# EAGLE design Kodi Remote (EAGLE 7.2.0)
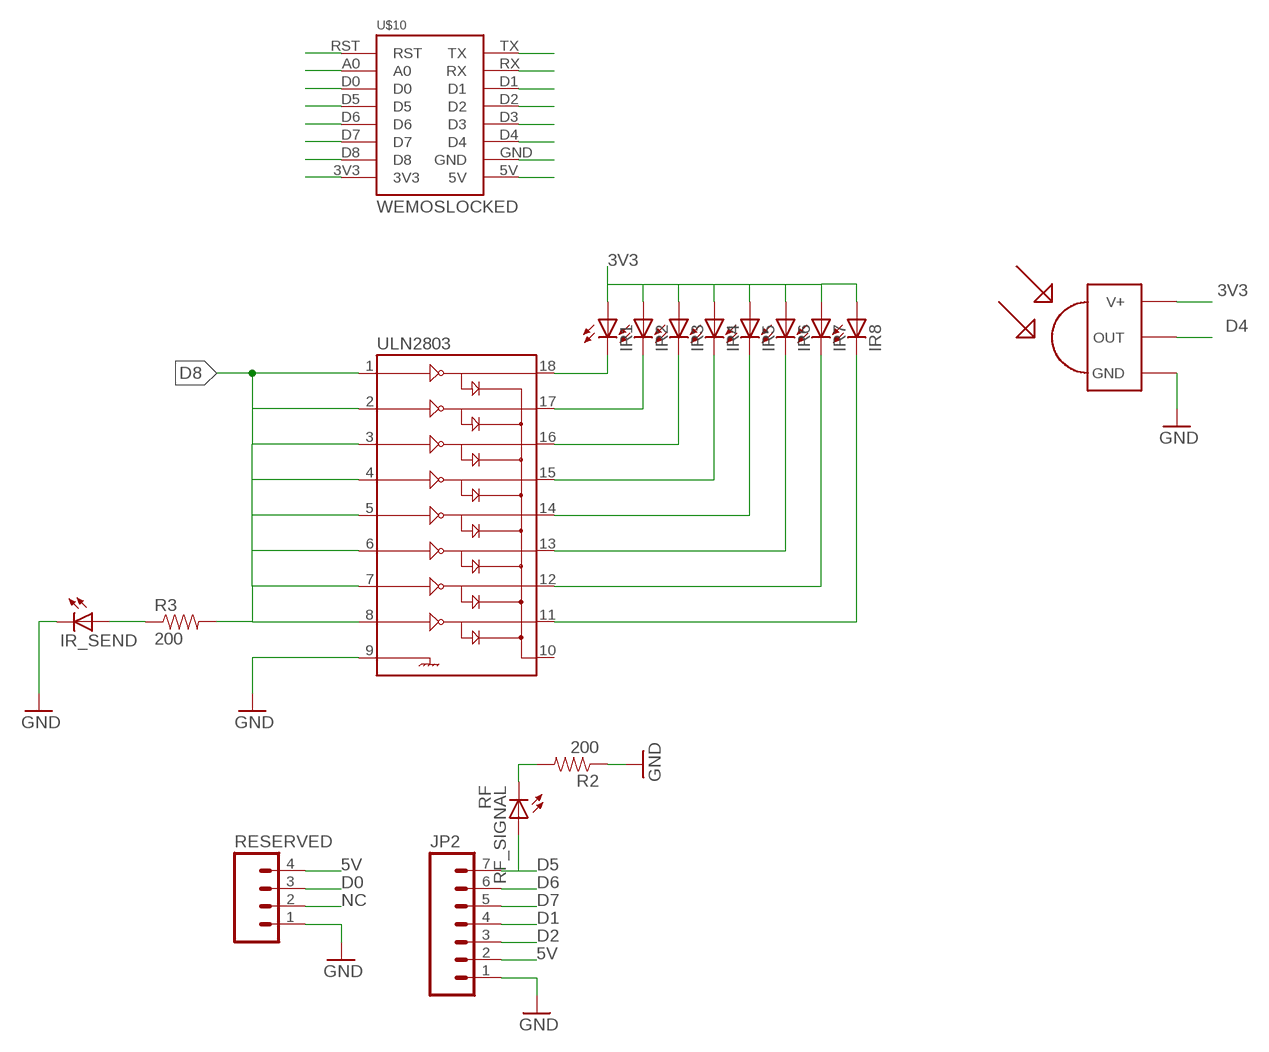
[diagram p0: schematic, sheet 1]

## Parts
IR1  LED5MM  [LED5MM]
IR2  LED5MM  [LED5MM]
IR3  LED5MM  [LED5MM]
IR4  LED5MM  [LED5MM]
IR5  LED5MM  [LED5MM]
IR6  LED5MM  [LED5MM]
IR7  LED5MM  [LED5MM]
IR8  LED5MM  [LED5MM]
IR_SEND  LED3MM  [LED3MM]
JP2  M07  [1X07]
R2  200  RESISTOR0805-RES  [0805]
R3  200  RESISTOR0805-RES  [0805]
RESERVED  M04PTH  [1X04]
RF_SIGNAL  RF  LED3MM  [LED3MM]
TSOP1838  TSOP1838  [TSOP18XX]
U$10  WEMOSLOCKED  [WEMOS_LOCKED]
ULN2803  ULN2803DIP  [DIL18]

## Nets
3V3: IR1.A IR2.A IR3.A IR4.A IR5.A IR6.A IR7.A IR8.A TSOP1838.VCC(V+) U$10.3V3
5V: JP2.2 RESERVED.4 U$10.5V
A1: U$10.A0
D0: RESERVED.3 U$10.D0
D1: JP2.4 U$10.D1
D2: JP2.3 U$10.D2
D3: U$10.D3
D4: TSOP1838.OUT U$10.D4
D5: JP2.7 RF_SIGNAL.A U$10.D5
D6: JP2.6 U$10.D6
D7: JP2.5 U$10.D7
D8: R3.2 U$10.D8 ULN2803.1 ULN2803.2 ULN2803.3 ULN2803.4 ULN2803.5 ULN2803.6 ULN2803.7 ULN2803.8
GND: IR_SEND.K(C) JP2.1 R2.1 RESERVED.1 TSOP1838.GND ULN2803.9
GND1: U$10.GND
IR4: IR4.K(C) ULN2803.15
N$1: R2.2 RF_SIGNAL.K(C)
N$4: IR_SEND.A R3.1
N$9: IR1.K(C) ULN2803.18
N$11: IR2.K(C) ULN2803.17
N$12: IR3.K(C) ULN2803.16
N$14: IR5.K(C) ULN2803.14
N$15: IR6.K(C) ULN2803.13
N$16: IR7.K(C) ULN2803.12
N$17: IR8.K(C) ULN2803.11
NC: RESERVED.2
RST1: U$10.RST
RX1: U$10.RX
TX1: U$10.TX
Unconnected: ULN2803.10

## Library data of the parts
IR1-IR8 IR_SEND RF_SIGNAL = adafruit:LED: LED OSRAM: - CHIPLED LG R971, LG N971, LY N971, LG Q971, LY Q971, LO R971, LY R971 LH N974, LH R974 LS Q976, LO Q976, LY Q976 LO Q996 - Hyper CHIPLED LW Q18S LB Q993, LB Q99A, LB R99A - SideLED LS A670, LO A670, LY A670, LG A670, LP A670 LB A673, LV A673, LT A673, LW A673 LH A674 LY A675 LS A676, LA A676, LO A676, LY A676, LW A676 LS A679, LY A679, LG A679 - Hyper Micro SIDELED® LS Y876, LA Y876, LO Y876, LY Y876 LT Y87S - SmartLED LW L88C, LW L88S LB L89C, LB L89S, LG L890 LS L89K, LO L89K, LY L89K LS L896, LA L896, LO L896, LY L896 - TOPLED LS T670, LO T670, LY T670, LG T670, LP T670 LSG T670, LSP T670, LSY T670, LOP T670, LYG T670 LG T671, LOG T671, LSG T671 LB T673, LV T673, LT T673, LW T673 LH T674 LS T676, LA T676, LO T676, LY T676, LB T676, LH T676, LSB T676, LW T676 LB T67C, LV T67C, LT T67C, LS T67K, LO T67K, LY T67K, LW E67C LS E67B, LA E67B, LO E67B, LY E67B, LB E67C, LV E67C, LT E67C LW T67C LS T679, LY T679, LG T679 LS T770, LO T770, LY T770, LG T770, LP T770 LB T773, LV T773, LT T773, LW T773 LH T774 LS E675, LA E675, LY E675, LS T675 LS T776, LA T776, LO T776, LY T776, LB T776 LHGB T686 LT T68C, LB T68C - Hyper Mini TOPLED® LB M676 - Mini TOPLED Santana® LG M470 LS M47K, LO M47K, LY M47K Source: http://www.osram.convergy.de/
JP2 = SparkFun-Connectors:M07: Header 7 Standard 7-pin 0.1" header. Use with straight break away headers (SKU : PRT-00116), right angle break away headers (PRT-00553), swiss pins (PRT-00743), machine pins (PRT-00117), and female headers (PRT-00115). NOTES ON THE VARIANTS LOCK and LOCK_LONGPADS... This footprint was designed to help hold the alignment of a through-hole component (i.e. 7-pin header) while soldering it into place. You may notice that each hole has been shifted either up or down by 0.005 of an inch from it's more standard position (which is usually a perfectly straight line). This slight alteration caused the pins (the squares in the middle) to touch the edges of the holes. Because they are alternating, it causes a "brace" to hold the header in place. 0.005 has proven to be the perfect amount of "off-center" position when using our standard breakaway headers. Although looks a little odd when you look at the bare footprint, once you have a header in there, the alteration is very hard to notice. Also, if you push a header all the way into place, it is covered up entirely on the bottom side. This idea of altering the position of holes to aid alignment will be further integrated into the Sparkfun Library for other footprints. It can help hold any component with 3 or more connection pins.
R2 R3 = SparkFun-Resistors:RESISTOR: Resistor Basic schematic elements and footprints for 0603, 1206, and PTH resistors.
RESERVED = SparkFun-Connectors:M04: Header 4 Standard 4-pin 0.1" header. Use with straight break away headers (SKU : PRT-00116), right angle break away headers (PRT-00553), swiss pins (PRT-00743), machine pins (PRT-00117), and female headers (PRT-00115). Molex polarized connector foot print use with SKU : PRT-08231 with associated crimp pins and housings. 1MM SMD Version SKU: PRT-10208
TSOP1838 = tsop:TSOP1838: IR Receiver and Demodulator
U$10 = My Eagle Lib:WEMOS
ULN2803 = SparkFun-PowerIC:ULN2803: Darlington Driver ULN2803 Darlington array. 500mA max per channel, 8-channel package. Spark Fun Electronics SKU : COM-00312

## Board
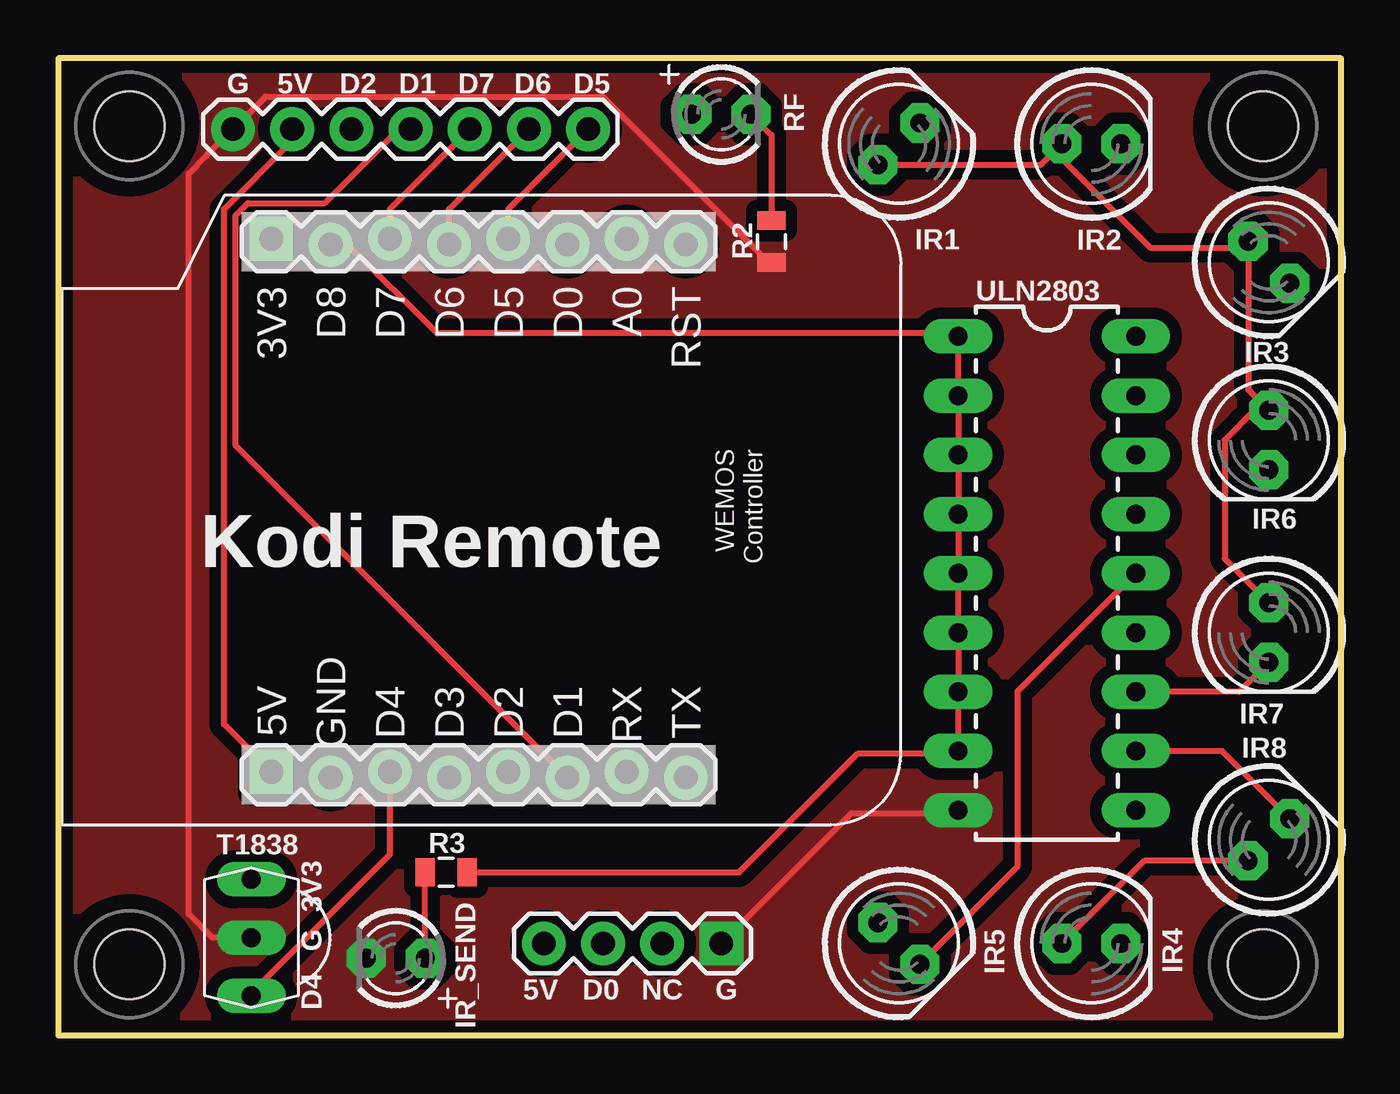
[diagram p1: board, top side]
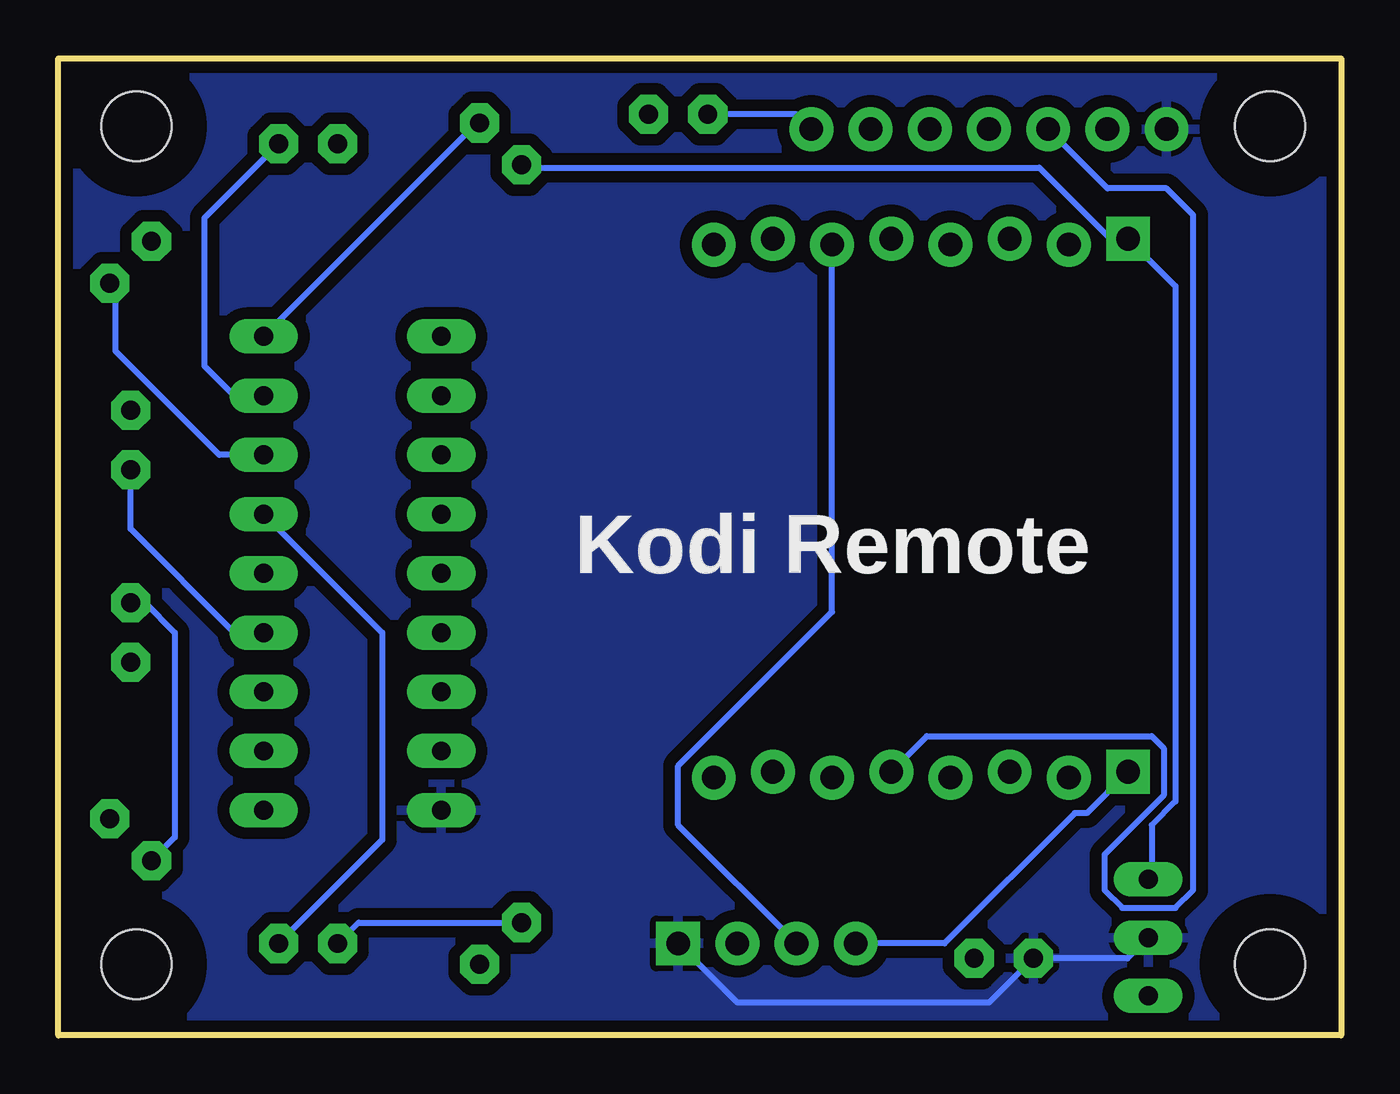
[diagram p2: board, bottom side, seen from below]

Size 55.04 x 41.9 mm. Coordinates in mm from the lower left corner, seen from the top.
Outline: 0,0 55.04,0 55.04,41.9 0,41.9 0,0
Copper layers (1*16): Top 0.035mm / dielectric 1.5mm / Bottom 0.035mm
Design rules "default *": minimum track width 10mil, minimum drill 24mil, track to track 10mil, track to pad 10mil, pad to pad 10mil, via to via 10mil, smd to smd 8mil, copper to edge 20mil, drill to drill 12mil, minimum pad ring 13mil, minimum via ring 10mil, stop-mask expansion 4mil, vias tented up to drill 0mil, thermal gap 10mil

### Footprints (pad centres in the part's own frame; a part is rotated, then mirrored left to right if it is on the bottom)
LED5MM = drill 0.813 pad 1.676 octagon: A -1.27,0; K 1.27,0
LED3MM = drill 0.813 pad 1.676 octagon: A -1.27,0; K 1.27,0
1X07 = drill 1.016 pad 1.88: 1 0,0; 2 2.54,0; 3 5.08,0; 4 7.62,0; 5 10.16,0; 6 12.7,0; 7 15.24,0
0805 = smd 0.8 x 1.2: 1 -0.9,0; 2 0.9,0
1X04 = drill 1.016 pad 1.88 square: 1 0,0 | drill 1.016 pad 1.88: 2 2.54,0; 3 5.08,0; 4 7.62,0
TSOP18XX = drill 0.813 long: GND -0.001,-0.027; OUT -2.501,-0.027; VCC 2.499,-0.027
KFH-M3 = hole 3: 0,0
WEMOS_LOCKED = drill 1.016 pad 1.88 square: 3V3 -0.127,0; 5V 22.733,0 | drill 1.016 pad 1.88: A0 -0.127,15.24; D0 0.127,12.7; D1 22.987,12.7; D2 22.733,10.16; D3 22.987,7.62; D4 22.733,5.08; D5 -0.127,10.16; D6 0.127,7.62; D7 -0.127,5.08; D8 0.127,2.54; GND 22.987,2.54; RST 0.127,17.78; RX 22.733,15.24; TX 22.987,17.78
DIL18 = drill 0.813 long: 1 -10.16,-3.81; 2 -7.62,-3.81; 3 -5.08,-3.81; 4 -2.54,-3.81; 5 0,-3.81; 6 2.54,-3.81; 7 5.08,-3.81; 8 7.62,-3.81; 9 10.16,-3.81; 10 10.16,3.81; 11 7.62,3.81; 12 5.08,3.81; 13 2.54,3.81; 14 0,3.81; 15 -2.54,3.81; 16 -5.08,3.81; 17 -7.62,3.81; 18 -10.16,3.81

### Placement (x,y rotation side)
IR1  36.07,38.23 45 top
IR2  44.32,38.23 0 top
IR3  51.94,33.15 315 top
IR4  44.32,3.94 0 top
IR5  36.07,3.94 315 top
IR6  51.94,25.53 270 top
IR7  51.94,17.27 270 top
IR8  51.94,8.38 45 top
IR_SEND  14.48,3.3 180 top
JP2  7.49,38.86 0 top
R2  30.61,34.04 90 top
R3  16.64,6.99 0 top
RESERVED  28.45,3.94 180 top
RF_SIGNAL  28.45,39.5 0 top
TSOP1838  8.25,4.19 90 top
U$6  [KFH-M3]  3.05,3.05 0 top
U$7  [KFH-M3]  51.69,3.05 0 top
U$8  [KFH-M3]  51.69,38.99 0 top
U$9  [KFH-M3]  3.05,38.99 0 top
U$10  9.14,34.04 270 top
ULN2803  42.42,19.81 270 top

### Tracks (layer width: path | path; a pad name or v marks a point on that pad's centre or on a via)
3V3
  Top 0.254: IR1.A 42.16,37.33 IR2.A 43.05,37.59 46.86,33.78 50.78,33.78 IR3.A 51.05,27.7 IR6.A 51.31,26.8 50.04,25.53 50.04,20.45 IR7.A | IR8.A 46.6,7.48 IR4.A
  Bottom 0.254: IR7.A 51.31,18.54 50.04,17.27 50.04,8.49 IR8.A | IR4.A 42.16,4.84 IR5.A | TSOP1838.VCC 8.13,6.73 8.13,9.02 7.11,10.03 7.11,32.13 U$10.3V3 9.91,34.16 12.95,37.21 35.05,37.21 IR1.A
5V
  Top 0.254: U$10.5V 7.11,13.34 7.11,35.43 9.91,38.23 9.91,38.73 JP2.2
  Bottom 0.254: RESERVED.4 17.02,3.94 11.43,9.53 10.92,9.53 U$10.5V
D0
  Bottom 0.254: U$10.D0 21.84,18.16 28.45,11.56 28.45,9.02 RESERVED.3
D1
  Top 0.254: U$10.D1 7.62,25.27 7.62,35.18 8.13,35.69 11.43,35.69 14.48,38.73 14.99,38.73 JP2.4
D2
  Bottom 0.254: U$10.D2 17.78,12.83 8.13,12.83 7.62,12.32 7.62,10.29 10.16,7.75 10.16,6.22 9.4,5.46 7.11,5.46 6.35,6.22 6.35,35.18 7.49,36.32 10.03,36.32 JP2.3
D4
  Top 0.254: U$10.D4 14.22,7.75 8.38,1.91 TSOP1838.OUT
D5
  Top 0.254: U$10.D5 19.3,35.43 JP2.7
  Bottom 0.254: JP2.7 23.37,39.5 RF_SIGNAL.A
D6
  Top 0.254: U$10.D6 16.76,35.43 JP2.6
D7
  Top 0.254: U$10.D7 14.22,35.43 JP2.5
D8
  Top 0.254: U$10.D8 12.45,33.91 16.26,30.1 38.61,30.1 ULN2803.1 ULN2803.2 ULN2803.3 ULN2803.4 ULN2803.5 ULN2803.6 ULN2803.7 ULN2803.8 38.61,12.07 34.29,12.07 29.21,6.99 R3.2
GND
  Top 0.254: RESERVED.1 34.04,9.53 38.61,9.53 ULN2803.9 | R2.1 30.48,33.15 23.37,40.26 8.89,40.26 JP2.1 6.86,38.23 6.35,37.72 5.59,36.96 5.59,5.21 6.6,4.19 8.13,4.19 TSOP1838.GND
  Bottom 0.254: TSOP1838.GND 9.17,3.3 IR_SEND.K 15.11,1.4 25.91,1.4 RESERVED.1
  pour Bottom (isolate 0.508): -4.57,45.21 62.99,45.09 62.99,-3.17 -4.57,-3.05
  pour Top (isolate 0.508, no thermals): -4.57,45.21 62.99,45.09 62.99,-3.17 -4.57,-3.05
IR4
  Bottom 0.254: IR4.K 41.15,8.38 41.15,17.27 ULN2803.15
N$1
  Top 0.254: RF_SIGNAL.K 30.61,38.61 R2.2
N$4
  Top 0.254: IR_SEND.A R3.1
N$9
  Bottom 0.254: IR1.K 37.08,39.12 ULN2803.18
N$11
  Bottom 0.254: ULN2803.17 47.5,27.43 48.77,28.7 48.77,35.05 IR2.K
N$12
  Bottom 0.254: ULN2803.16 48.13,24.89 52.58,29.34 52.58,31.99 IR3.K
N$14
  Top 0.254: ULN2803.14 41.15,14.73 41.15,7.22 IR5.K
N$15
  Bottom 0.254: ULN2803.13 47.5,17.27 51.94,21.72 IR6.K
N$16
  Top 0.254: ULN2803.12 50.67,14.73 IR7.K
N$17
  Top 0.254: ULN2803.11 49.93,12.19 IR8.K

### Text on the board
tNames: G | 5V | D2 | D1 | D7 | D6 | D5 | Kodi Remote | T1838 | 3V3 | G | D4 | 5V | D0 | NC | G
bNames: Kodi Remote